# Altium schematic sheet 09_FPGA_misc.SchDoc: FPGA misc (power, clocks, config)
size A3; Organization: Lime Microsystems; Address1: Surrey Tech Centre; Address2: Guildford GU2 7YG; Address3: Surrey; Address4: United Kingdom; Revision: v1.2; SheetNumber: 9; SheetTotal: 14
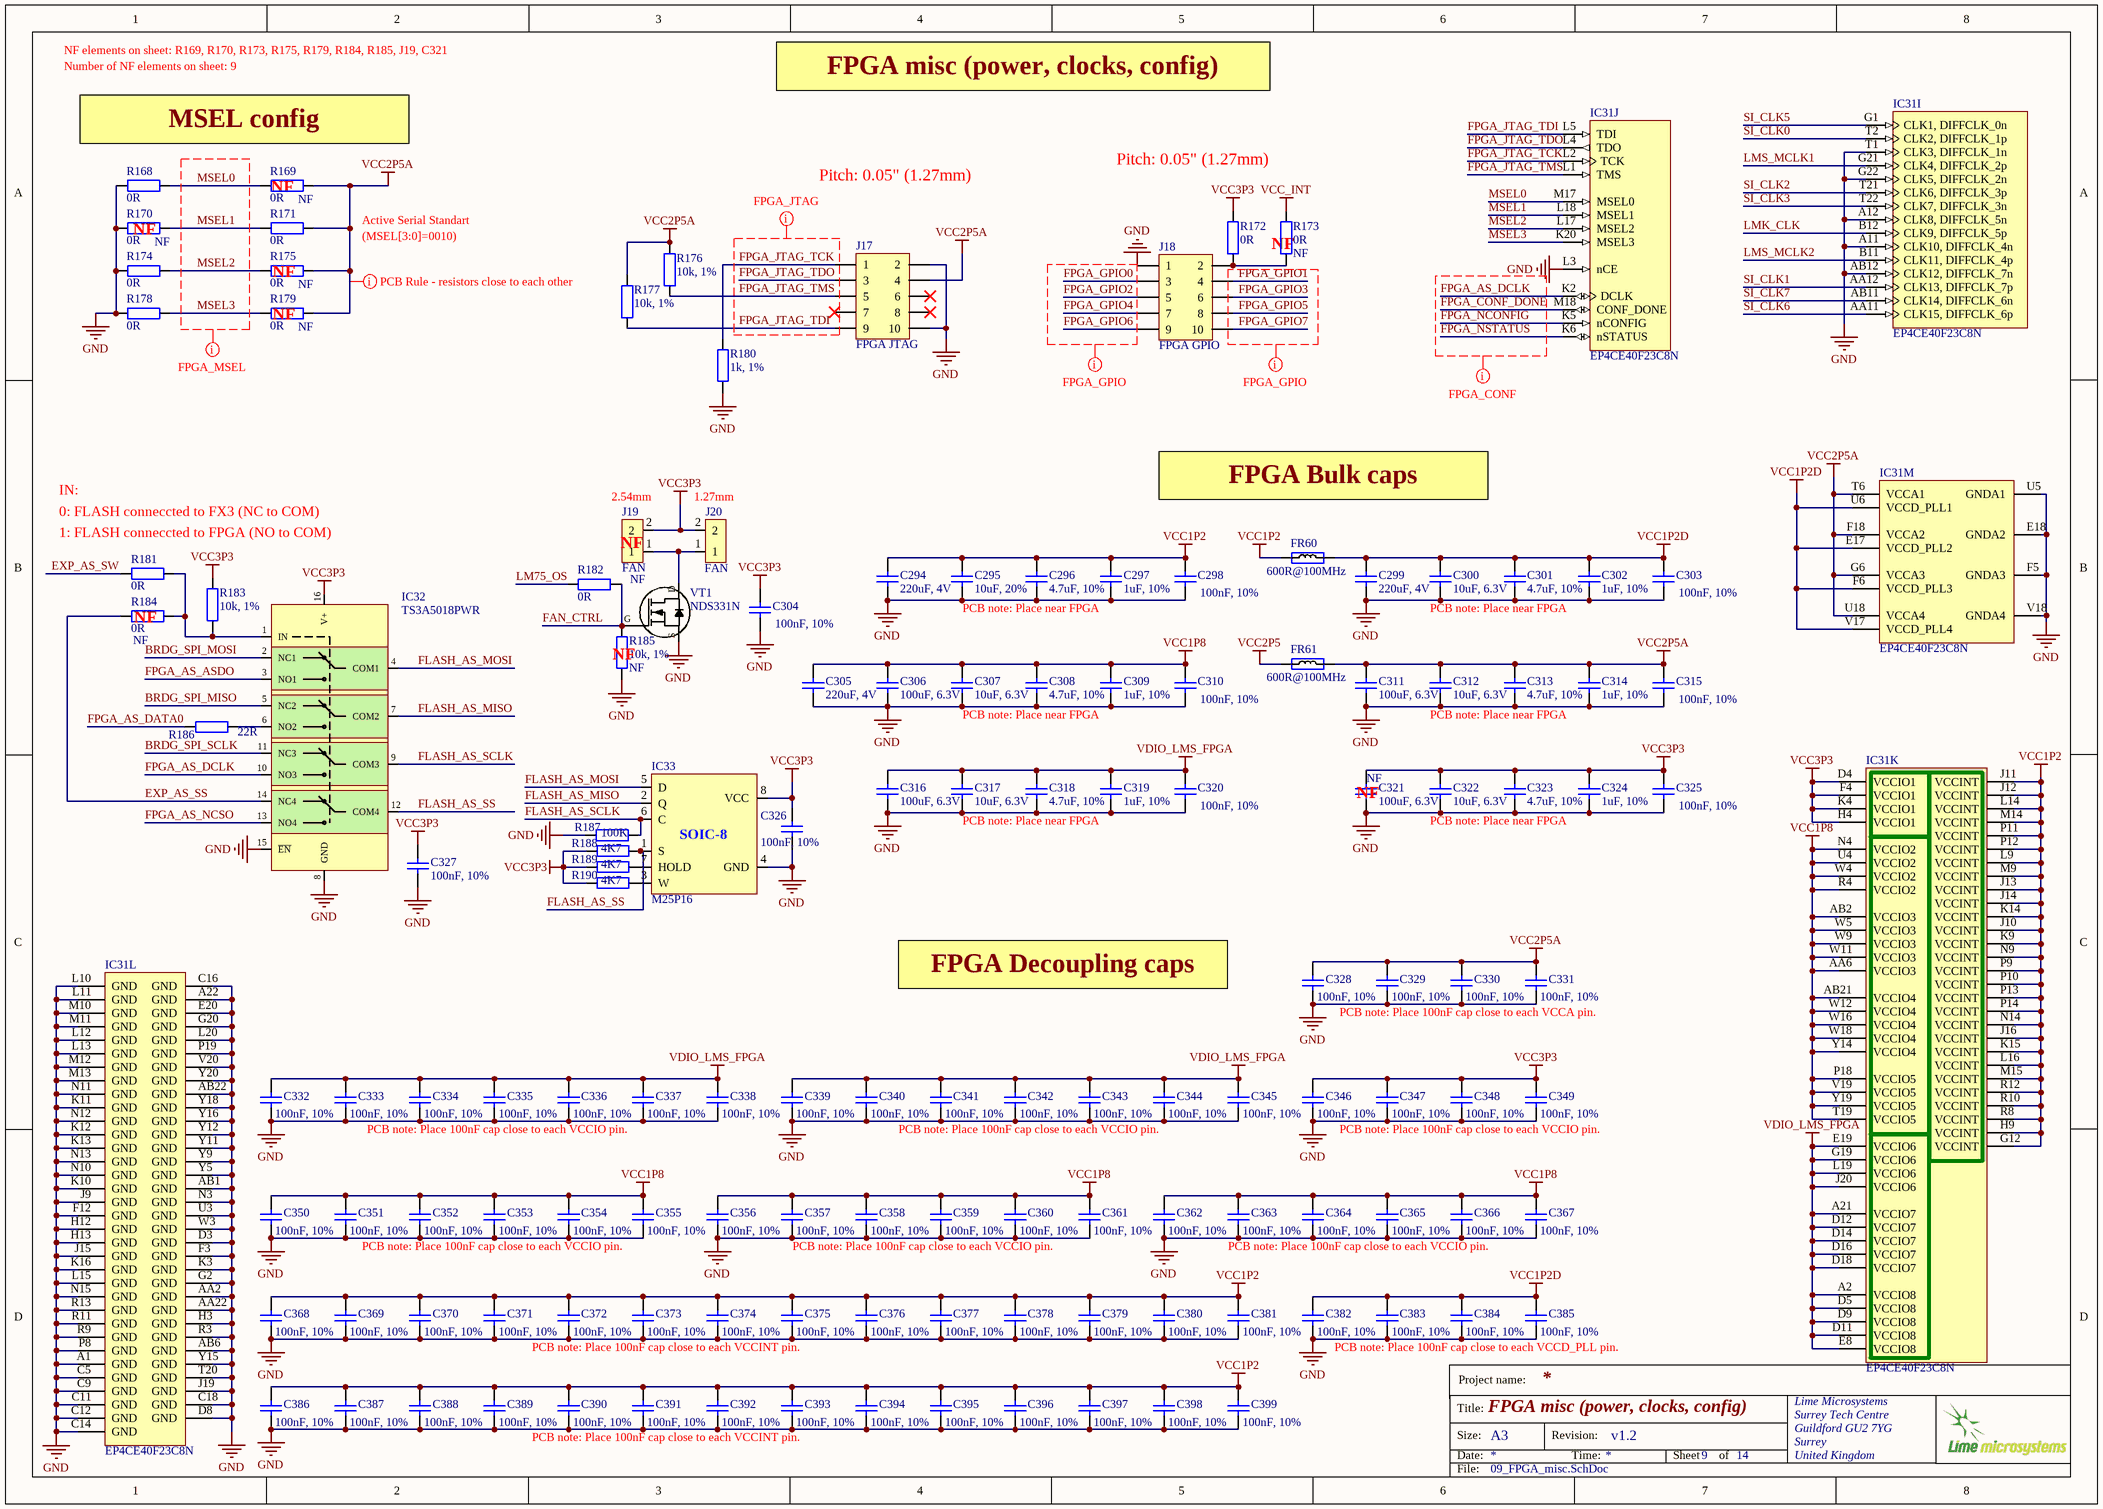
[diagram p0: 09_FPGA_misc.SchDoc]

## Parts
C294  220uF, 4V  [CAP1206]
C295  10uF, 20%  [CAP0603]
C296  4.7uF, 10%  [CAP0603]
C297  1uF, 10%  [CAP0402]
C298  100nF, 10%  [CAP0402]
C299  220uF, 4V  [CAP1206]
C300  10uF, 6.3V  [CAP0603]
C301  4.7uF, 10%  [CAP0603]
C302  1uF, 10%  [CAP0402]
C303  100nF, 10%  [CAP0402]
C304  100nF, 10%  [CAP0402]
C305  220uF, 4V  [CAP1206]
C306  100uF, 6.3V  [CAP1206]
C307  10uF, 6.3V  [CAP0603]
C308  4.7uF, 10%  [CAP0603]
C309  1uF, 10%  [CAP0402]
C310  100nF, 10%  [CAP0402]
C311  100uF, 6.3V  [CAP1206]
C312  10uF, 6.3V  [CAP0603]
C313  4.7uF, 10%  [CAP0603]
C314  1uF, 10%  [CAP0402]
C315  100nF, 10%  [CAP0402]
C316  100uF, 6.3V  [CAP1206]
C317  10uF, 6.3V  [CAP0603]
C318  4.7uF, 10%  [CAP0603]
C319  1uF, 10%  [CAP0402]
C320  100nF, 10%  [CAP0402]
C321  100uF, 6.3V  Assembly Info: NF  [CAP1206]
C322  10uF, 6.3V  [CAP0603]
C323  4.7uF, 10%  [CAP0603]
C324  1uF, 10%  [CAP0402]
C325  100nF, 10%  [CAP0402]
C326  100nF, 10%  [CAP0402]
C327  100nF, 10%  [CAP0402]
C328  100nF, 10%  [CAP0402]
C329  100nF, 10%  [CAP0402]
C330  100nF, 10%  [CAP0402]
C331  100nF, 10%  [CAP0402]
C332  100nF, 10%  [CAP0402]
C333  100nF, 10%  [CAP0402]
C334  100nF, 10%  [CAP0402]
C335  100nF, 10%  [CAP0402]
C336  100nF, 10%  [CAP0402]
C337  100nF, 10%  [CAP0402]
C338  100nF, 10%  [CAP0402]
C339  100nF, 10%  [CAP0402]
C340  100nF, 10%  [CAP0402]
C341  100nF, 10%  [CAP0402]
C342  100nF, 10%  [CAP0402]
C343  100nF, 10%  [CAP0402]
C344  100nF, 10%  [CAP0402]
C345  100nF, 10%  [CAP0402]
C346  100nF, 10%  [CAP0402]
C347  100nF, 10%  [CAP0402]
C348  100nF, 10%  [CAP0402]
C349  100nF, 10%  [CAP0402]
C350  100nF, 10%  [CAP0402]
C351  100nF, 10%  [CAP0402]
C352  100nF, 10%  [CAP0402]
C353  100nF, 10%  [CAP0402]
C354  100nF, 10%  [CAP0402]
C355  100nF, 10%  [CAP0402]
C356  100nF, 10%  [CAP0402]
C357  100nF, 10%  [CAP0402]
C358  100nF, 10%  [CAP0402]
C359  100nF, 10%  [CAP0402]
C360  100nF, 10%  [CAP0402]
C361  100nF, 10%  [CAP0402]
C362  100nF, 10%  [CAP0402]
C363  100nF, 10%  [CAP0402]
C364  100nF, 10%  [CAP0402]
C365  100nF, 10%  [CAP0402]
C366  100nF, 10%  [CAP0402]
C367  100nF, 10%  [CAP0402]
C368  100nF, 10%  [CAP0402]
C369  100nF, 10%  [CAP0402]
C370  100nF, 10%  [CAP0402]
C371  100nF, 10%  [CAP0402]
C372  100nF, 10%  [CAP0402]
C373  100nF, 10%  [CAP0402]
C374  100nF, 10%  [CAP0402]
C375  100nF, 10%  [CAP0402]
C376  100nF, 10%  [CAP0402]
C377  100nF, 10%  [CAP0402]
C378  100nF, 10%  [CAP0402]
C379  100nF, 10%  [CAP0402]
C380  100nF, 10%  [CAP0402]
C381  100nF, 10%  [CAP0402]
C382  100nF, 10%  [CAP0402]
C383  100nF, 10%  [CAP0402]
C384  100nF, 10%  [CAP0402]
C385  100nF, 10%  [CAP0402]
C386  100nF, 10%  [CAP0402]
C387  100nF, 10%  [CAP0402]
C388  100nF, 10%  [CAP0402]
C389  100nF, 10%  [CAP0402]
C390  100nF, 10%  [CAP0402]
C391  100nF, 10%  [CAP0402]
C392  100nF, 10%  [CAP0402]
C393  100nF, 10%  [CAP0402]
C394  100nF, 10%  [CAP0402]
C395  100nF, 10%  [CAP0402]
C396  100nF, 10%  [CAP0402]
C397  100nF, 10%  [CAP0402]
C398  100nF, 10%  [CAP0402]
C399  100nF, 10%  [CAP0402]
FR60  600R@100MHz  [RES0805]
FR61  600R@100MHz  [RES0805]
IC31  EP4CE40F23C8N  [FBGA484_A-240]  (parts I,J,K,L,M of 13)
IC32  TS3A5018PWR  [TS3A5018PWR]
IC33  M25P16  [M25P40-VMN6TPB_SO8N]
J17  FPGA JTAG  [SWD_10_pin]
J18  FPGA GPIO  [SWD_10_pin]
J19  FAN  Assembly Info: NF  [HDR_1x2]
J20  FAN  [HDR_1x2_HALF_PITCH]
R168  0R  [RES0402]
R169  0R  Assembly Info: NF  [RES0402]
R170  0R  Assembly Info: NF  [RES0402]
R171  0R  [RES0402]
R172  0R  [RES0402]
R173  0R  Assembly Info: NF  [RES0402]
R174  0R  [RES0402]
R175  0R  Assembly Info: NF  [RES0402]
R176  10k, 1%  [RES0402]
R177  10k, 1%  [RES0402]
R178  0R  [RES0402]
R179  0R  Assembly Info: NF  [RES0402]
R180  1k, 1%  [RES0402]
R181  0R  [RES0402]
R182  0R  [RES0402]
R183  10k, 1%  [RES0402]
R184  0R  Assembly Info: NF  [RES0402]
R185  10k, 1%  Assembly Info: NF  [RES0402]
R186  22R  [RES0402]
R187  100K  [RES0402]
R188  4K7  [RES0402]
R189  4K7  [RES0402]
R190  4K7  [RES0402]
VT1  NDS331N  [SOT23-3]

## Nets
GND: C294.1 C295.1 C296.1 C297.2 C298.2 C299.1 C300.1 C301.1 C302.2 C303.2 C304.2 C305.1 C306.1 C307.1 C308.1 C309.1 C310.2 C311.1 C312.1 C313.1 C314.1 C315.2 C316.1 C317.1 C318.1 C319.1 C320.2 C321.1 C322.1 C323.1 C324.1 C325.2 C326.2 C327.2 C328.2 C329.2 C330.2 C331.2 C332.2 C333.2 C334.2 C335.2 C336.2 C337.2 C338.2 C339.2 C340.2 C341.2 C342.2 C343.2 C344.2 C345.2 C346.2 C347.2 C348.2 C349.2 C350.2 C351.2 C352.2 C353.2 C354.2 C355.2 C356.2 C357.2 C358.2 C359.2 C360.2 C361.2 C362.2 C363.2 C364.2 C365.2 C366.2 C367.2 C368.2 C369.2 C370.2 C371.2 C372.2 C373.2 C374.2 C375.2 C376.2 C377.2 C378.2 C379.2 C380.2 C381.2 C382.2 C383.2 C384.2 C385.2 C386.2 C387.2 C388.2 C389.2 C390.2 C391.2 C392.2 C393.2 C394.2 C395.2 C396.2 C397.2 C398.2 C399.2 IC31.A1(GND) IC31.A11(CLK10,_DIFFCLK_4n) IC31.A12(CLK8,_DIFFCLK_5n) IC31.A22(GND) IC31.AA2(GND) IC31.AA22(GND) IC31.AB1(GND) IC31.AB6(GND) IC31.AB12(CLK12,_DIFFCLK_7n) IC31.AB22(GND) IC31.C5(GND) IC31.C9(GND) IC31.C11(GND) IC31.C12(GND) IC31.C14(GND) IC31.C16(GND) IC31.C18(GND) IC31.D3(GND) IC31.D8(GND) IC31.E18(GNDA2) IC31.E20(GND) IC31.F3(GND) IC31.F5(GNDA3) IC31.F12(GND) IC31.G2(GND) IC31.G20(GND) IC31.G22(CLK5,_DIFFCLK_2n) IC31.H3(GND) IC31.H12(GND) IC31.H13(GND) IC31.J9(GND) IC31.J15(GND) IC31.J19(GND) IC31.K3(GND) IC31.K10(GND) IC31.K11(GND) IC31.K12(GND) IC31.K13(GND) IC31.K16(GND) IC31.L3(nCE) IC31.L10(GND) IC31.L11(GND) IC31.L12(GND) IC31.L13(GND) IC31.L15(GND) IC31.L20(GND) IC31.M10(GND) IC31.M11(GND) IC31.M12(GND) IC31.M13(GND) IC31.N3(GND) IC31.N10(GND) IC31.N11(GND) IC31.N12(GND) IC31.N13(GND) IC31.N15(GND) IC31.P8(GND) IC31.P19(GND) IC31.R3(GND) IC31.R9(GND) IC31.R11(GND) IC31.R13(GND) IC31.T1(CLK3,_DIFFCLK_1n) IC31.T20(GND) IC31.U3(GND) IC31.U5(GNDA1) IC31.V18(GNDA4) IC31.V20(GND) IC31.W3(GND) IC31.Y5(GND) IC31.Y9(GND) IC31.Y11(GND) IC31.Y12(GND) IC31.Y15(GND) IC31.Y16(GND) IC31.Y18(GND) IC31.Y20(GND) IC32.8(GND) IC32.15(~{EN}) IC33.4(GND) J17.2 J17.10 J18.1 R168.2 R170.2 R174.2 R178.2 R180.2 R185.2 R187.2 VT1.S
VCC1P2: C294.2 C295.2 C296.2 C297.1 C298.1 C368.1 C369.1 C370.1 C371.1 C372.1 C373.1 C374.1 C375.1 C376.1 C377.1 C378.1 C379.1 C380.1 C381.1 C386.1 C387.1 C388.1 C389.1 C390.1 C391.1 C392.1 C393.1 C394.1 C395.1 C396.1 C397.1 C398.1 C399.1 FR60.1 IC31.G12(VCCINT) IC31.H9(VCCINT) IC31.J10(VCCINT) IC31.J11(VCCINT) IC31.J12(VCCINT) IC31.J13(VCCINT) IC31.J14(VCCINT) IC31.J16(VCCINT) IC31.K9(VCCINT) IC31.K14(VCCINT) IC31.K15(VCCINT) IC31.L9(VCCINT) IC31.L14(VCCINT) IC31.L16(VCCINT) IC31.M9(VCCINT) IC31.M14(VCCINT) IC31.M15(VCCINT) IC31.N9(VCCINT) IC31.N14(VCCINT) IC31.P9(VCCINT) IC31.P10(VCCINT) IC31.P11(VCCINT) IC31.P12(VCCINT) IC31.P13(VCCINT) IC31.P14(VCCINT) IC31.R8(VCCINT) IC31.R10(VCCINT) IC31.R12(VCCINT)
VCC1P2D: C299.2 C300.2 C301.2 C302.1 C303.1 C382.1 C383.1 C384.1 C385.1 FR60.2 IC31.E17(VCCD_PLL2) IC31.F6(VCCD_PLL3) IC31.U6(VCCD_PLL1) IC31.V17(VCCD_PLL4)
VCC1P8: C305.2 C306.2 C307.2 C308.2 C309.2 C310.1 C350.1 C351.1 C352.1 C353.1 C354.1 C355.1 C356.1 C357.1 C358.1 C359.1 C360.1 C361.1 C362.1 C363.1 C364.1 C365.1 C366.1 C367.1 IC31.AA6(VCCIO3) IC31.AB2(VCCIO3) IC31.AB21(VCCIO4) IC31.N4(VCCIO2) IC31.P18(VCCIO5) IC31.R4(VCCIO2) IC31.T19(VCCIO5) IC31.U4(VCCIO2) IC31.V19(VCCIO5) IC31.W4(VCCIO2) IC31.W5(VCCIO3) IC31.W9(VCCIO3) IC31.W11(VCCIO3) IC31.W12(VCCIO4) IC31.W16(VCCIO4) IC31.W18(VCCIO4) IC31.Y14(VCCIO4) IC31.Y19(VCCIO5)
VCC2P5: FR61.1
VCC2P5A: C311.2 C312.2 C313.2 C314.2 C315.1 C328.1 C329.1 C330.1 C331.1 FR61.2 IC31.F18(VCCA2) IC31.G6(VCCA3) IC31.T6(VCCA1) IC31.U18(VCCA4) J17.4 R169.1 R171.1 R175.1 R176.2 R177.2 R179.1
VCC3P3: C304.1 C321.2 C322.2 C323.2 C324.2 C325.1 C326.1 C327.1 C346.1 C347.1 C348.1 C349.1 IC31.D4(VCCIO1) IC31.F4(VCCIO1) IC31.H4(VCCIO1) IC31.K4(VCCIO1) IC32.16(V+) IC33.8(VCC) J19.2 J20.2 R172.1 R183.1 R188.1 R189.1 R190.1
VCC_INT: R173.1
VDIO_LMS_FPGA: C316.2 C317.2 C318.2 C319.2 C320.1 C332.1 C333.1 C334.1 C335.1 C336.1 C337.1 C338.1 C339.1 C340.1 C341.1 C342.1 C343.1 C344.1 C345.1 IC31.A2(VCCIO8) IC31.A21(VCCIO7) IC31.D5(VCCIO8) IC31.D9(VCCIO8) IC31.D11(VCCIO8) IC31.D12(VCCIO7) IC31.D14(VCCIO7) IC31.D16(VCCIO7) IC31.D18(VCCIO7) IC31.E8(VCCIO8) IC31.E19(VCCIO6) IC31.G19(VCCIO6) IC31.J20(VCCIO6) IC31.L19(VCCIO6)
BRDG_SPI_MISO: IC32.5(NC2)
BRDG_SPI_MOSI: IC32.2(NC1)
BRDG_SPI_SCLK: IC32.11(NC3)
EXP_AS_SS: IC32.14(NC4) R184.2
EXP_AS_SW: R181.2
FAN_CTRL: R182.2 R185.1 VT1.G
FLASH_AS_MISO: IC32.7(COM2) IC33.2(Q)
FLASH_AS_MOSI: IC32.4(COM1) IC33.5(D)
FLASH_AS_SCLK: IC32.9(COM3) IC33.6(C) R187.1
FLASH_AS_SS: IC32.12(COM4) IC33.1(S) R188.2
FPGA_AS_ASDO: IC32.3(NO1)
FPGA_AS_DATA0: R186.2
FPGA_AS_DCLK: IC31.K2(DCLK) IC32.10(NO3)
FPGA_AS_NCSO: IC32.13(NO4)
FPGA_CONF_DONE: IC31.M18(CONF_DONE)
FPGA_GPIO0: J18.3
FPGA_GPIO1: J18.4
FPGA_GPIO2: J18.5
FPGA_GPIO3: J18.6
FPGA_GPIO4: J18.7
FPGA_GPIO5: J18.8
FPGA_GPIO6: J18.9
FPGA_GPIO7: J18.10
FPGA_JTAG_TCK: IC31.L2(TCK) J17.1 R180.1
FPGA_JTAG_TDI: IC31.L5(TDI) J17.9 R177.1
FPGA_JTAG_TDO: IC31.L4(TDO) J17.3
FPGA_JTAG_TMS: IC31.L1(TMS) J17.5 R176.1
FPGA_NCONFIG: IC31.K5(nCONFIG)
FPGA_NSTATUS: IC31.K6(nSTATUS)
LM75_OS: R182.1
LMK_CLK: IC31.B12(CLK9,_DIFFCLK_5p)
LMS_MCLK1: IC31.G21(CLK4,_DIFFCLK_2p)
LMS_MCLK2: IC31.B11(CLK11,_DIFFCLK_4p)
MSEL0: IC31.M17(MSEL0) R168.1 R169.2
MSEL1: IC31.L18(MSEL1) R170.1 R171.2
MSEL2: IC31.L17(MSEL2) R174.1 R175.2
MSEL3: IC31.K20(MSEL3) R178.1 R179.2
SI_CLK0: IC31.T2(CLK2,_DIFFCLK_1p)
SI_CLK1: IC31.AA12(CLK13,_DIFFCLK_7p)
SI_CLK2: IC31.T21(CLK6,_DIFFCLK_3p)
SI_CLK3: IC31.T22(CLK7,_DIFFCLK_3n)
SI_CLK5: IC31.G1(CLK1,_DIFFCLK_0n)
SI_CLK6: IC31.AA11(CLK15,_DIFFCLK_6p)
SI_CLK7: IC31.AB11(CLK14,_DIFFCLK_6n)
NetIC32_1: IC32.1(IN) R181.1 R183.2 R184.1
NetIC32_6: IC32.6(NO2) R186.1
NetIC33_3: IC33.3(W) R190.2
NetIC33_7: IC33.7(HOLD) R189.2
NetJ18_2: J18.2 R172.2 R173.2
NetJ19_1: J19.1 J20.1 VT1.D

Not connected (* = marked no-connect by the designer): J17 6* 7* 8*

## Layout directives
rule Undefined: VCC2P5A
net class FPGA_MSEL: MSEL0, MSEL1, MSEL2, MSEL3
net class FPGA_GPIO: FPGA_GPIO0, FPGA_GPIO1, FPGA_GPIO2, FPGA_GPIO3, FPGA_GPIO4, FPGA_GPIO5, FPGA_GPIO6, FPGA_GPIO7
net class FPGA_JTAG: FPGA_JTAG_TCK, FPGA_JTAG_TDI, FPGA_JTAG_TDO, FPGA_JTAG_TMS
net class FPGA_CONF: FPGA_AS_DCLK, FPGA_CONF_DONE, FPGA_NCONFIG, FPGA_NSTATUS

## Notes on the sheet
- NF elements on sheet: R169, R170, R173, R175, R179, R184, R185, J19, C321
- Number of NF elements on sheet: 9
- FPGA misc (power, clocks, config)
- MSEL config
- Pitch: 0.05" (1.27mm)
- (near R170) NF
- (near R169) NF
- Active Serial Standart
- (MSEL[3:0]=0010)
- (near R173) NF
- (near R175) NF
- (near R179) NF
- 0: FLASH conneccted to FX3 (NC to COM)
- IN:
- (near J19) 2.54mm
- (near J20) 1.27mm
- FPGA Bulk caps
- 1: FLASH conneccted to FPGA (NO to COM)
- (near J19) NF
- (near R184) NF
- PCB note: Place near FPGA
- (near R185) NF
- (near C321) NF
- FPGA Decoupling caps
- PCB note: Place 100nF cap close to each VCCA pin.
- PCB note: Place 100nF cap close to each VCCIO pin.
- PCB note: Place 100nF cap close to each VCCINT pin.
- PCB note: Place 100nF cap close to each VCCD_PLL pin.
- Project name:
- Title:
- Size:
- Date:
- A3
- Revision:
- Time:
- Sheet
- of
- File:
- (in symbol M25P40) SOIC-8

## Library data of the parts
C294 C299 C305 = Cap_1206: Manufacturer Part Number: GRM31CR60G227ME11L; Manufacturer: Murata Electronics North America; Part Description: 220µF ±20% 4V X5R Ceramic Capacitor -55°C ~ 85°C Surface Mount, MLCC 1206 (3216 Metric) 0.126" L x 0.063" W (3.20mm x 1.60mm); Capacitance: 220µF; Temperature Coefficient: X5R; Tolerance: ±20%; Package / Case: 1206 (3216 Metric); Supplier 1: Digi-Key; Packaging: Cut Tape (CT); Size / Dimension: 0.126" L x 0.063" W (3.20mm x 1.60mm); Operating Temperature: -55°C ~ 85°C; Voltage - Rated: 4V; Mounting Type: Surface Mount, MLCC; Ratings: -; Supplier Part Number 1: 490-9774-1-ND; Category: Capacitors; Lead Spacing: -; Lead Style: -; Applications: General Purpose; Features: -; Height - Seated (Max): -; Thickness (Max): 0.075" (1.90mm); RoHS: RoHS Compliant; Value: 220uF, 4V
C295 = Cap_0603: Manufacturer: Yageo; Manufacturer Part Number 1: GRM188R61C106MA73D; Part Description: 10µF ±20% 16V X5R Ceramic Capacitor -55°C ~ 85°C Surface Mount, MLCC 0603 (1608 Metric) 0.063" L x 0.031" W (1.60mm x 0.80mm); Temperature Coefficient: X5R; Capacitance: 10µF; Voltage - Rated: 16V; Value: 10uF, 20%; Supplier 1: Digi-Key; Supplier Part Number 1: 490-7201-2-ND; Category: Capacitors; Ratings: -; Features: -; Lead Style: -; Package / Case: 0603 (1608 Metric); Lead Spacing: -; Applications: General Purpose; Operating Temperature: -55°C ~ 85°C; Tolerance: ±20%; Thickness (Max): 0.039" (1.00mm); Mounting Type: Surface Mount, MLCC; RoHS: RoHS Compliant; Size / Dimension: 0.063" L x 0.031" W (1.60mm x 0.80mm); Packaging: Tape & Reel (TR); Height - Seated (Max): -
C296 C301 C308 C313 C318 C323 = Cap_0603: Manufacturer Part Number 1: CGB3B1X5R1A475K055AC; Part Description: 4.7µF ±10% 10V X5R Ceramic Capacitor -55°C ~ 85°C Surface Mount, MLCC 0603 (1608 Metric) 0.063" L x 0.031" W (1.60mm x 0.80mm); Voltage Rating DC: 10 V; Temperature Coefficient / Code: +/- 15 %; Supplier 1: Mouser; Supplier Part Number 1: 810-CGB3B1X5R1A475KC; Capacitance: 4.7 uF; Operating Temperature Range: - 55 C to + 85 C; Category: Multilayer Ceramic Capacitors MLCC - SMD/SMT; Case Code - in: 0603; Package / Case: 0603 (1608 metric); Tolerance: 10 %; value: 4.7uF, 10%
C297 C302 C309 C314 C319 C324 = Cap_0402: Manufacturer Part Number 1: GRM155R61A105KE15J; Manufacturer: TDK; Part Description: 1µF ±10% 10V X5R Ceramic Capacitor -55°C ~ 85°C Surface Mount, MLCC 0402 (1005 Metric) 0.039" L x 0.020" W (1.00mm x 0.50mm); Voltage Rating: 10; Product Range: TDK - C Series; Ceramic Capacitor Case: 0402 [1005 Metric]; Capacitance: 1; Dielectric Characteristic: X6; Value: 1uF, 10%; Supplier 1: Newark; Supplier Part Number 1: 490-6298-2-ND; Capacitance Tolerance: ± 10%; MSL: -; RoHS: YES
C298 C303 C304 C310 C315 C320 C325-C399 = Cap_0603: Manufacturer Part Number 1: GRM155R71C104KA88D; Part Description: 0.10µF ±10% 16V X7R Ceramic Capacitor -55°C ~ 125°C Surface Mount, MLCC 0402 (1005 Metric) 0.039" L x 0.020" W (1.00mm x 0.50mm); Brand: Murata Electronics; Type: General Purpose MLCC; Capacitance: 0.1 uF; Temperature Coefficient / Code: +/- 15 %; Voltage Rating DC: 16 V; Supplier 1: Mouser; Supplier Part Number 1: 81-GRM155R71C104KA88; Tolerance: 10 %; Case Code - in: 0402; Manufacturer: Murata Electronics; Category: Multilayer Ceramic Capacitors MLCC - SMD/SMT; Value: 100nF, 10%; Manufacturer Part Number: GRM155R71C104KA88D
C300 C307 C312 C317 C322 = Cap_0603: Manufacturer Part Number 1: CC0603MRX5R5BB106; Part Description: 10µF ±20% 6.3V X5R Ceramic Capacitor -55°C ~ 85°C Surface Mount, MLCC 0603 (1608 Metric) 0.063" L x 0.031" W (1.60mm x 0.80mm); Manufacturer: Yageo; Capacitance: 10µF; Tolerance: ±20%; Supplier 1: Digi-Key; Supplier Part Number 1: 311-1448-2-ND; Package / Case: 0603 (1608 Metric); Category: Capacitors; Voltage - Rated: 6.3V; Value: 10uF, 6.3V
C306 C311 C316 C321 = Cap_1206: Manufacturer: MURATA; Manufacturer Part Number 1: GRM31CR60J107ME39L.; Part Description: 100µF ±20% 6.3V X5R Ceramic Capacitor -55°C ~ 85°C Surface Mount, MLCC 1206 (3216 Metric) 0.126" L x 0.063" W (3.20mm x 1.60mm); Capacitance Tolerance: ± 20%; Ceramic Capacitor Case: 1206 [3216 Metric]; Voltage Rating: 6.3; value: 100uF, 6.3V; Supplier Part Number 1: 1735535; Supplier 1: Farnell
FR60 FR61 = Ferrite: Manufacturer Part Number 1: MPZ2012S601AT000; Manufacturer: TDK Corporation; Part Description: FERRITE BEAD 600 OHM 0805 1LN; Filter Type: Differential Mode - Single; Impedance @ Frequency: 600 Ohm @ 100MHz; DC Resistance (DCR): 100 mOhm Max; Current Rating: 2A; Supplier 1: Digi-Key; Supplier Part Number 1: 445-2206-2-ND; Mounting Type: Surface Mount; RoHS: RoHS Compliant; Height (Max): 0.041" (1.05mm); Packaging: Tape & Reel (TR); Category: Filters; Package / Case: 0805 (2012 Metric); Size / Dimension: 0.079" L x 0.049" W (2.00mm x 1.25mm)
IC31 = EP4CE40F23C7N: IC FPGA 328 I/O 484FBGA; Manufacturer: Altera; Number of I/O: 328; Number of LABs/CLBs: 2475; Number of Logic Elements/Cells: 39600; Total RAM Bits: 1161216; Voltage - Supply: 1.15 V ~ 1.25 V; DatasheetVersion: ver1.6, Nov-2011; PackageDescription: 484-Pin FineLine Ball Grid Array (FBGA) - Wire Bond - A:2.40; Code_JEDEC: MS-034-AAJ-1; ComponentLink1Description: Manufacturer URL; ComponentLink1URL: http://www.altera.com/; ComponentLink2Description: Handbook; ComponentLink2URL: http://www.altera.com/literature/hb/cyclone-iv/cyclone4-handbook.pdf; ComponentLink3Description: Pinout; ComponentLink3URL: http://www.altera.com/literature/lit-dp.jsp?category=cyc%204&showspreadsheet=y; ComponentLink4Description: Package Specification; ComponentLink4URL: http://www.altera.com/devicepackaging/04R00247-02.pdf; Category: Integrated Circuits (ICs); Manufacturer Part Number 1: EP4CE40F23C8N; Mounting Type: Surface Mount; Number of Gates: -; Operating Temperature: 0°C ~ 85°C; Package / Case: 484-BGA; RoHS: RoHS Compliant; Supplier 1: Digi-Key; Supplier Device Package: 484-FBGA (23x23); Supplier Part Number 1: 544-2811-ND; Part Description: IC FPGA 328 I/O 484FBGA
IC32 = TS3A5018PWR: Manufacturer: TEXAS INSTRUMENTS; Part Description: IC SWITCH QUAD SPDT 16TSSOP; On State Resistance Max: 10; Analog Switch Case: TSSOP; Supply Voltage Range: 2.3V to 3.6; No. of Pins: 16; Analog Switch Type: SPDT; Supplier 1: Newark; Manufacturer Part Number 1: TS3A5018PW; Supplier Part Number 1: 71J8329
IC33 = M25P40: Manufacturer Part Number 1: M25P16-VMN6P; Manufacturer: Micron Technology Inc.; Part Description: IC FLASH 16MBIT 75MHZ 8SO; Supply Voltage Min: 2.7; Supply Voltage Max: 3.6; Memory Case Style: NSOIC; Memory Type: Flash; Memory Size: 16; Flash Memory Configuration: 2M x 8; No. of Pins: 8; Clock Frequency: 75; IC Interface Type: Serial, SPI; Page / Burst Read Access: 0.8; Supply Voltage Range: 2.7V to 3.6; Supplier 1: Farnell; Supplier Part Number 1: 1734973; RoHS: YES; Access Time: -; Operating Temperature Min: -40; Operating Temperature Max: 85; Packaging: Each; MSL: MSL 3 - 168 hours; Memory Voltage Vcc: 3.6; Operating Temperature Range: -40°C to +85
J17 J18 = Header 5X2_SWD: Header, 5-Pin, Dual row; Manufacturer Part Number 1: M50-3600542; Manufacturer: Harwin Inc; Part Description: CONN HDR 1.27MM SMD AU 10POS; Number of Positions: 10; Molding Height Above Board: 0.039" (1.00mm); Row Spacing: 0.050" (1.27mm); Number of Positions Loaded: All; Connector Type: Unshrouded; Supplier 1: Digi-Key; Contact Mating Length: 0.118" (3.00mm); Category: Connectors, Interconnects; Color: Black; RoHS: RoHS Compliant; Number of Rows: 2; Contact Finish Thickness: 3µin (0.08µm); Height Stacking (Mating): -; Contact Finish: Gold; Termination: Solder; Mounting Type: Surface Mount; Pitch: 0.050" (1.27mm); Features: -; Packaging: Bulk; Supplier Part Number 1: 952-1389-ND
J19 = Jumper: Manufacturer Part Number 1: 961102-6404-AR; Part Description: 2 Positions Header, Unshrouded Connector 0.100" (2.54mm) Through Hole Gold; Connector Type: Header, Unshrouded; Supplier 1: Digi-Key; Supplier Part Number 1: 3M9447-ND; Contact Type: Male Pin; Color: Black; Mounting Type: Through Hole; Category: Connectors, Interconnects; Contact Finish: Gold
J20 = Jumper: Manufacturer Part Number 1: GRPB021VWVN-RC; Manufacturer: Sullins Connector Solutions; Part Description: CONN SHUNT 1.27MM BLUE W/HANDLE; Connector Type: Header, Unshrouded; Number of Positions: 2; Number of Positions Loaded: All; Pitch: 0.050" (1.27mm); Supplier 1: Digi-Key; Supplier Part Number 1: S9014E-02-ND; Contact Mating Length: 0.118" (3.00mm); Mounting Type: Through Hole; Termination: Solder; Fastening Type: -; Features: -; Contact Finish: Gold; Contact Finish Thickness: Flash; Color: -; Category: Connectors, Interconnects; RoHS: RoHS Compliant; Packaging: Bulk; Contact Type: Male Pin; Number of Rows: 1; Row Spacing: -
R168-R175 R178 R179 R181 R182 R184 = Res_0402: Manufacturer: Yageo; Part Description: RES SMD 0.0OHM JUMPER 1/16W 0402; Supplier 1: Digi-Key; Supplier Part Number 1: 311-0.0JRTR-ND; Composition: Thick Film; Package / Case: 0402 (1005 Metric); Category: Resistors; Value: 0R
R176 R177 R183 R185 = Res_0402: Manufacturer: Yageo; Manufacturer Part Number 1: RC0402FR-0710KL; Part Description: RES SMD 10K OHM 1% 1/16W 0402; Temperature Coefficient: ±100ppm/°C; Power (Watts): 0.063W, 1/16W; Value: 10k, 1%; Supplier 1: Digi-Key; Supplier Part Number 1: 311-10.0KLRTR-ND; Resistance (Ohms): 10k; Packaging: Tape & Reel (TR); RoHS: RoHS Compliant; Package / Case: 0402 (1005 Metric); Tolerance: ±1%; Operating Temperature: -55°C ~ 155°C; Size / Dimension: 0.039" L x 0.020" W (1.00mm x 0.50mm); Number of Terminations: 2; Category: Resistors; Height: 0.016" (0.40mm); Supplier Device Package: 0402; Features: Moisture Resistant; Composition: Thick Film
R180 = Res_0402: Manufacturer: Stackpole Electronics Inc; Manufacturer Part Number 1: RMCF0402FT1K00; Part Description: RES SMD 1K OHM 1% 1/16W 0402; Temperature Coefficient: ±100ppm/°C; Power (Watts): 0.063W, 1/16W; Value: 1k, 1%; Supplier 1: Digi-Key; Supplier Part Number 1: RMCF0402FT1K00TR-ND; Package / Case: 0402 (1005 Metric); Supplier Device Package: 0402; Height: 0.016" (0.40mm); Size / Dimension: 0.039" L x 0.020" W (1.00mm x 0.50mm); Number of Terminations: 2; Packaging: Cut Tape (CT); Category: Resistors; Composition: Thick Film; Resistance (Ohms): 1k; Tolerance: ±1%; Features: Moisture Resistant; Operating Temperature: -55°C ~ 155°C; RoHS: RoHS Compliant
R186 = Res_0402: Part Description: RES SMD 22 OHM 1% 1/16W 0402; Tolerance: ±1%; Temperature Coefficient: ±100ppm/°C; Resistance (Ohms): 22; Supplier 1: Digi-Key; Supplier Part Number 1: 311-22.0LRTR-ND; Supplier Device Package: 0402; Composition: Thick Film; Category: Resistors; Value: 22R
R187 = Res_0402: Manufacturer Part Number 1: ERJ-2GEJ104X; Manufacturer: Panasonic Electronic Components; Part Description: RES SMD 100K OHM 5% 1/10W 0402; Tolerance: ±5%; Temperature Coefficient: ±200ppm/°C; Power (Watts): 0.1W, 1/10W; Supplier 1: Digi-Key; Supplier Part Number 1: P100KJCT-ND; Resistance (Ohms): 100k; Composition: Thick Film; Features: Automotive AEC-Q200; Number of Terminations: 2; Height: 0.016" (0.40mm); RoHS: RoHS Compliant; Package / Case: 0402 (1005 Metric); Packaging: Cut Tape (CT); Size / Dimension: 0.039" L x 0.020" W (1.00mm x 0.50mm); Supplier Device Package: 0402; Operating Temperature: -55°C ~ 155°C; Category: Resistors; value: 100K
R188-R190 = Res_0402: Manufacturer Part Number 1: RMCF0402JT4K70; Part Description: RES SMD 4.7K OHM 5% 1/16W 0402; Manufacturer: Stackpole Electronics Inc.; Temperature Coefficient: ±100ppm/°C; Resistance(Ohms): 4.7k; Tolerance: ±5%; Supplier 1: Digi-Key; Composition: Thick Film; Supplier Device Package: 0402; Supplier: Digi-Key; Supplier Part Number 1: RMCF0402JT4K70TR-ND; Category: Resistors; Value: 4K7
VT1 = NDS331N: Part Description: MOSFET N-CH 20V 1.3A SSOT3; Manufacturer: Fairchild Semiconductor; Gate Charge (Qg) @ Vgs: 5nC @ 4.5V; Power - Max: 460mW; Current - Continuous Drain (Id) @ 25°C: 1.3A (Ta); Input Capacitance (Ciss) @ Vds: 162pF @ 10V; FET Type: MOSFET N-Channel, Metal Oxide; Drain to Source Voltage (Vdss): 20V; FET Feature: Logic Level Gate; Supplier Device Package: 3-SSOT; Category: Discrete Semiconductor Products; Mounting Type: Surface Mount; Package / Case: TO-236-3, SC-59, SOT-23-3; Supplier 1: Digi-Key; Supplier Part Number 1: NDS331NCT-ND; Manufacturer Part Number 1: NDS331N